# EAGLE design arcie (EAGLE 6.3)
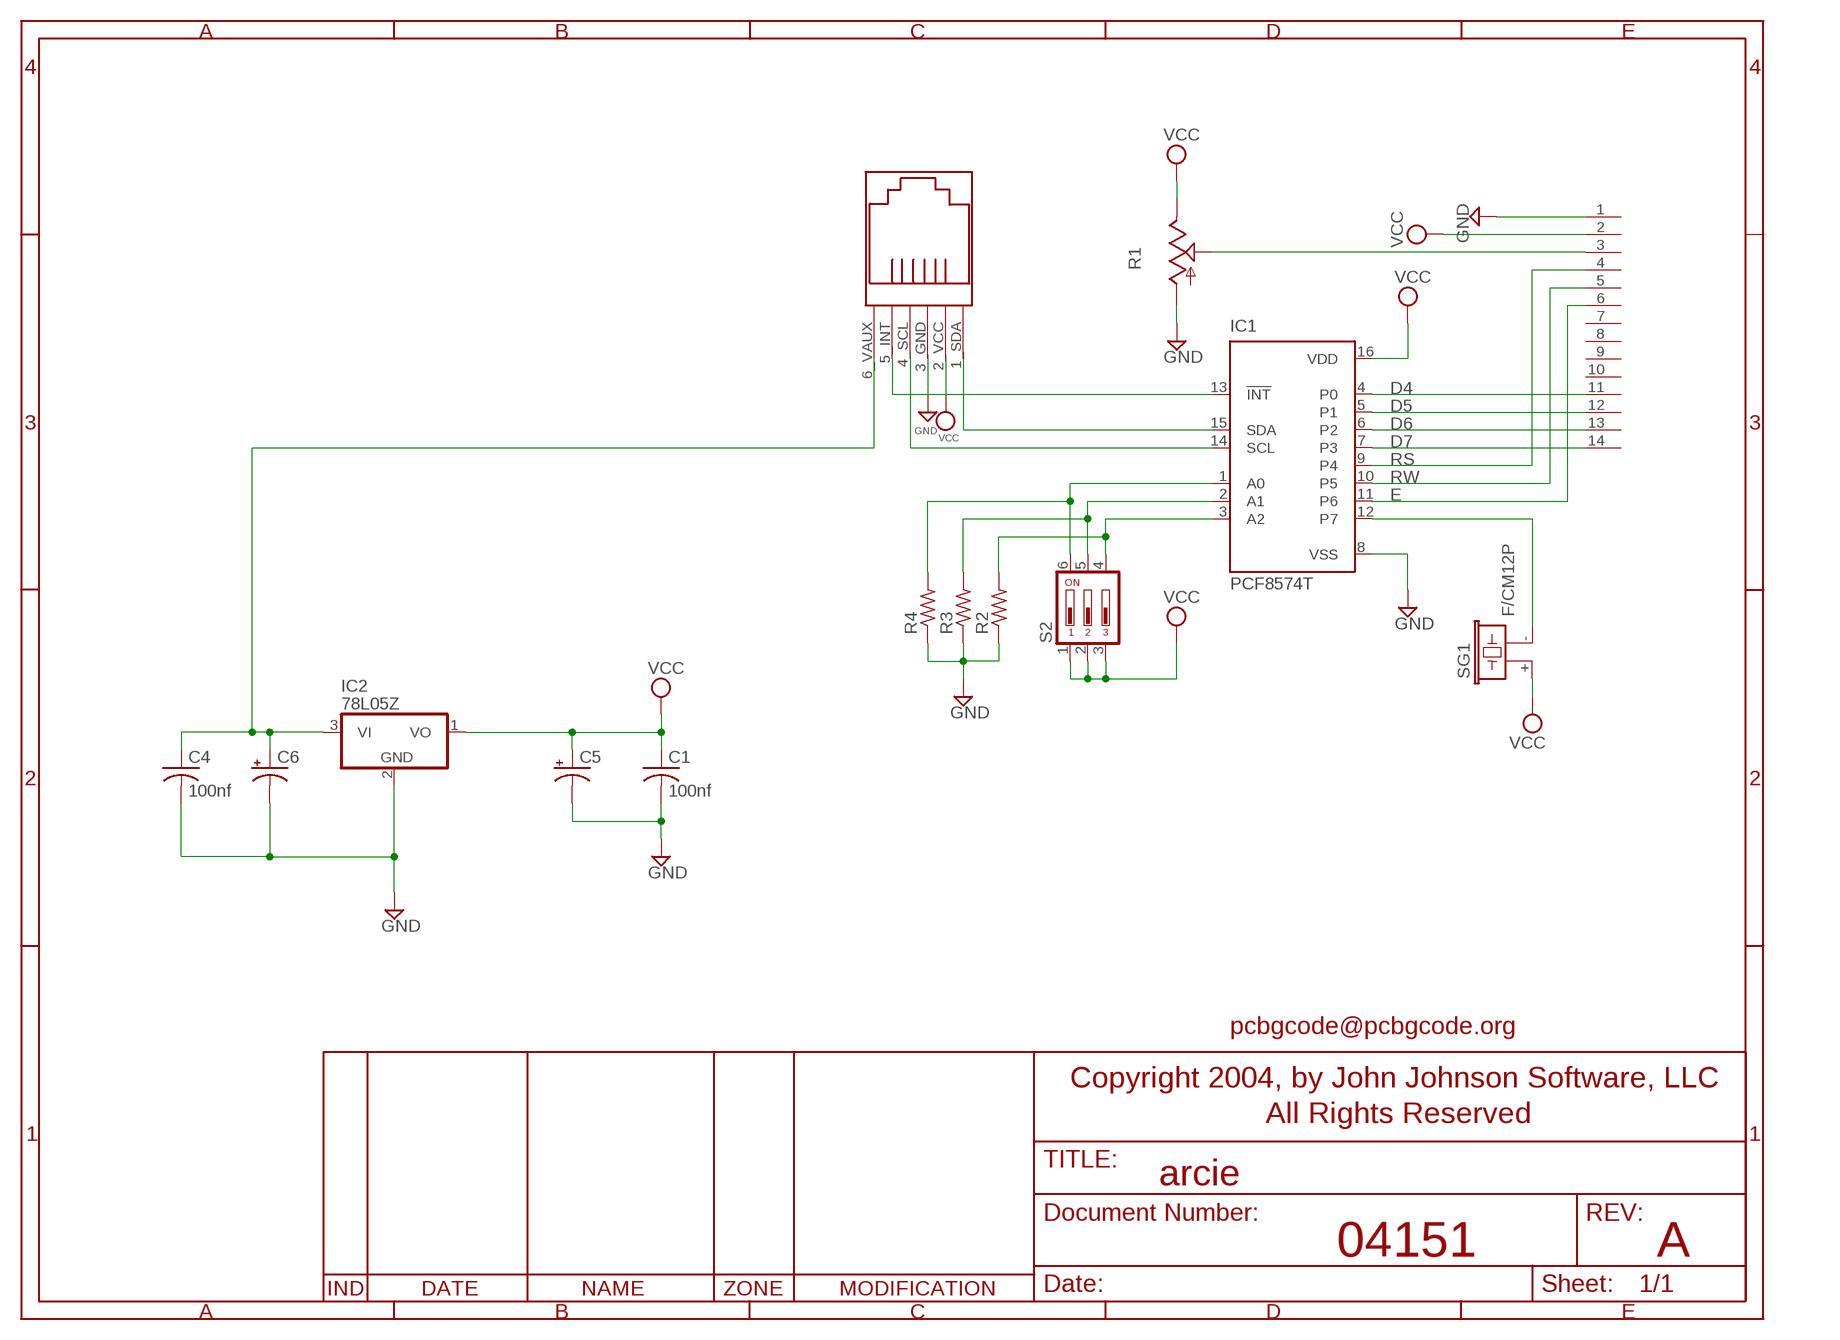
[diagram p0: schematic, sheet 1]

## Parts
C1  100nf  C-USC1206  [C1206]
C4  100nf  C-USC1206  [C1206]
C5  CPOL-US!FAT_E2,5-5  [!FAT_E2,5-5]
C6  CPOL-US!FAT_E2,5-5  [!FAT_E2,5-5]
IC1  PCF8574T  [SO16W]
IC2  78L05Z  [TO92]
R1  TRIM_US-PT-SPIN  [PT-SPIN]
R2  R-US_R1206  [R1206]
R3  R-US_R1206  [R1206]
R4  R-US_R1206  [R1206]
S2  DIP03YL  [DIP03YL]
SG1  F/CM12P  [F/CM12P]
U$1  RJ-12  [RJ-12]
U$2  MA07-2-SGL  [MA07-2]

## Nets
D4: IC1.4(P0) U$2.11
D5: IC1.5(P1) U$2.12
D6: IC1.6(P2) U$2.13
D7: IC1.7(P3) U$2.14
E: IC1.11(P6) U$2.6
GND: C1.2 C4.2 C5.P$2(-) C6.P$2(-) IC1.8(VSS) IC2.2(GND) R1.A R2.1 R3.1 R4.1 U$1.3_GND U$2.1
N$1: R1.S U$2.3
N$2: IC1.3(A2) R2.2 S2.4
N$3: IC1.2(A1) R3.2 S2.5
N$4: IC1.1(A0) R4.2 S2.6
N$5: IC1.13(!INT) U$1.5_INT
N$7: IC1.15(SDA) U$1.1_SDA
N$8: IC1.12(P7) SG1.-
N$9: IC1.14(SCL) U$1.4_SCL
N$12: C4.1 C6.P$1(+) IC2.3(VI) U$1.6_VAUX
RS: IC1.9(P4) U$2.4
RW: IC1.10(P5) U$2.5
VCC: C1.1 C5.P$1(+) IC1.16(VDD) IC2.1(VO) R1.E S2.1 S2.2 S2.3 SG1.+ U$1.2_VCC U$2.2
Unconnected: U$2.7 U$2.8 U$2.9 U$2.10

## Notes on the sheet
- pcbgcode@pcbgcode.org
- 04151 | A

## Library data of the parts
C1 C4 = rcl:C-US: CAPACITOR, American symbol
C5 C6 = rcl:CPOL-US: POLARIZED CAPACITOR, American symbol
IC1 = micro-philips:PCF8574: I2C-Bus I/O DEVICE
IC2 = linear:78*: Positive VOLTAGE REGULATOR
R1 = pot:TRIM_US-: POTENTIOMETER
R2-R4 = rcl:R-US_: RESISTOR, American symbol
S2 = switch-dil:DIP03YL: DIL/CODE SWITCH
SG1 = buzzer:F/CM12P: BUZZER Source: Buerklin
U$1 = con-rj:RJ-12
U$2 = con-lstb:MA07-2-SGL

## Net classes
0 default: width 0.406 mm

## Board
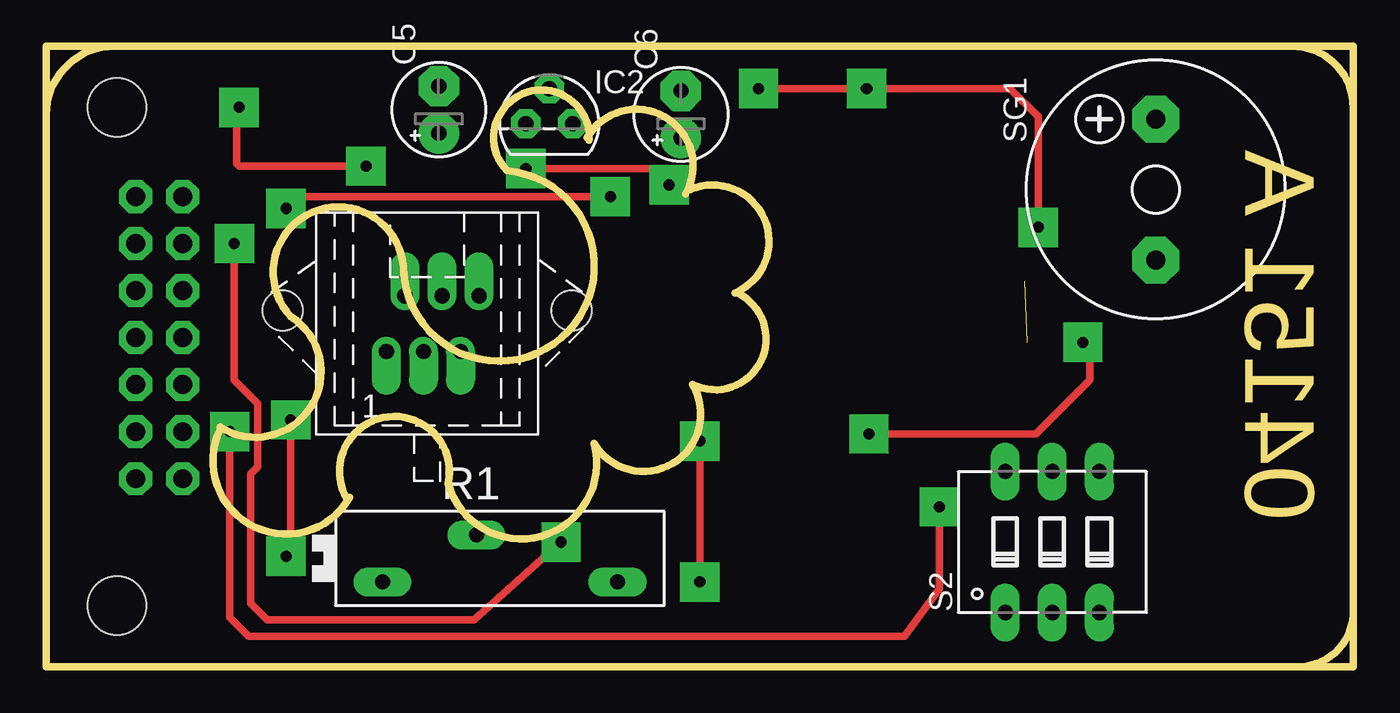
[diagram p1: board, top side]
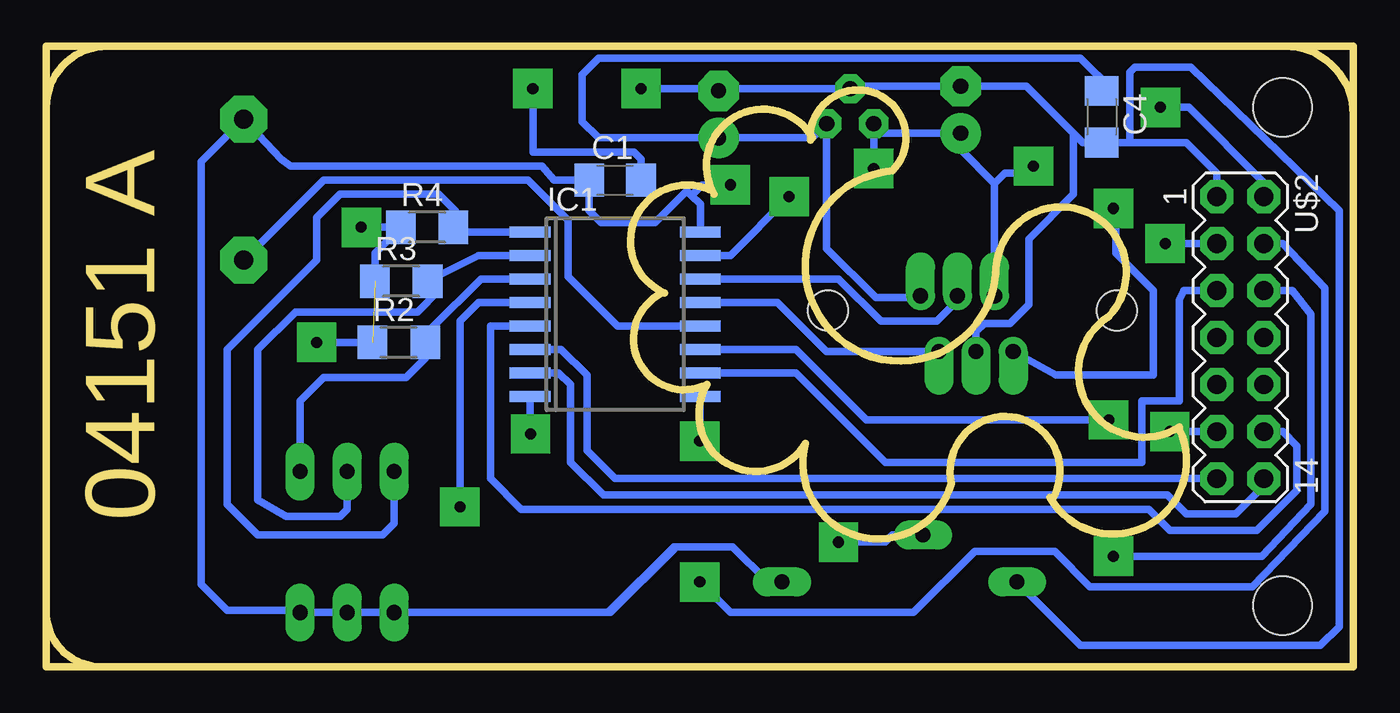
[diagram p2: board, bottom side, seen from below]

Size 70.61 x 33.53 mm. Coordinates in mm from the lower left corner, seen from the top.
Outline: 0,0 70.61,0 70.61,33.53 0,33.53 0,0
Copper layers (1*16): Top 0.035mm / dielectric 1.5mm / Bottom 0.035mm
Design rules "default *": minimum track width 16mil, minimum drill 18mil, track to track 10mil, track to pad 5mil, pad to pad 10mil, via to via 10mil, smd to smd 10mil, copper to edge 0mil, drill to drill 8mil, minimum pad ring 10mil, minimum via ring 30mil, stop-mask expansion 4mil, vias tented up to drill 0mil, thermal gap 16mil
Holes 3.17 mm at 3.81,30.23 3.81,3.3
Milling: 19 lines

### Footprints (pad centres in the part's own frame; a part is rotated, then mirrored left to right if it is on the bottom)
C1206 = smd 1.6 x 1.8: 1 -1.4,0; 2 1.4,0
!FAT_E2,5-5 = drill 0.813 pad 2.184: P$1 -1.27,0 | drill 0.813 pad 2.184 octagon: P$2 1.27,0
SO16W = smd 0.6 x 2.2: 1 -4.445,-4.6; 2 -3.175,-4.6; 3 -1.905,-4.6; 4 -0.635,-4.6; 5 0.635,-4.6; 6 1.905,-4.6; 7 3.175,-4.6; 8 4.445,-4.6; 9 4.445,4.6; 10 3.175,4.6; 11 1.905,4.6; 12 0.635,4.6; 13 -0.635,4.6; 14 -1.905,4.6; 15 -3.175,4.6; 16 -4.445,4.6
TO92 = drill 0.813 octagon: 1 -1.27,0; 2 0,1.905; 3 1.27,0
PT-SPIN = drill 0.813 long: A -6.35,-1.27; E 6.35,-1.27; S -1.27,1.27
R1206 = smd 1.6 x 1.803: 1 -1.422,0; 2 1.422,0
DIP03YL = drill 0.813 long: 1 -2.54,-3.81; 2 0,-3.81; 3 2.54,-3.81; 4 2.54,3.81; 5 0,3.81; 6 -2.54,3.81
F/CM12P = drill 1.016 pad 2.54 octagon: + 3.81,0; - -3.81,0
RJ-12 = drill 0.813 offset: 1_SDA 2.2,1.5; 2_VCC 1.2,-1.5; 3_GND 0.2,1.5; 4_SCL -0.8,-1.5; 5_INT -1.8,1.5; 6_VAUX -2.8,-1.5 | hole 2.184: -7.8,-0.7; 7.8,-0.7
MA07-2 = drill 1.016 octagon: 1 -7.62,-1.27; 2 -7.62,1.27; 3 -5.08,-1.27; 4 -5.08,1.27; 5 -2.54,-1.27; 6 -2.54,1.27; 7 0,-1.27; 8 0,1.27; 9 2.54,-1.27; 10 2.54,1.27; 11 5.08,-1.27; 12 5.08,1.27; 13 7.62,-1.27; 14 7.62,1.27

### Placement (x,y rotation side)
C1  39.88,26.29 0 bottom
C4  13.59,29.72 270 bottom
C5  21.21,30.1 90 top
C6  34.29,29.84 90 top
IC1  39.88,19.05 270 bottom
IC2  27.18,29.34 0 top
R1  24.51,5.84 0 top
R2  51.56,17.53 0 bottom
R3  51.44,20.83 0 bottom
R4  50.04,23.75 0 bottom
S2  54.36,6.73 0 top
SG1  59.94,25.78 90 top
U$1  20.57,18.54 180 top
U$2  6.1,17.78 270 bottom

### Tracks (layer width: path | path; a pad name or v marks a point on that pad's centre or on a via)
D4  (via drill 0.6)
  Top 0.406: v48.26,8.64 48.26,4.19 46.35,1.65 10.92,1.65 9.91,2.67 v9.91,12.7
  Bottom 0.406: U$2.11 v9.91,12.7 | v48.26,8.64 48.26,18.67 47.24,19.68 IC1.4
D5
  Bottom 0.406: U$2.12 3.81,12.7 3.05,11.94 3.05,9.53 5.21,7.37 9.91,7.37 11.05,8.51 44.96,8.51 46.61,10.16 46.61,18.41 IC1.5
D6
  Bottom 0.406: IC1.6 42.8,17.14 41.4,15.75 41.4,11.68 39.88,10.16 U$2.13
D7
  Bottom 0.406: U$2.14 4.83,9.78 6.35,8.26 9.02,8.26 10.03,9.27 40.51,9.27 42.29,11.05 42.29,15.24 42.93,15.88 IC1.7
E  (via drill 0.6)
  Top 0.406: v13.21,13.34 13.21,6.22 v12.95,5.97
  Bottom 0.406: IC1.11 30.1,17.14 26.29,13.34 v13.21,13.34 | v12.95,5.97 4.95,5.97 2.29,8.76 2.29,19.05 3.3,20.32 U$2.6
GND  (via drill 0.6)  (1 unrouted)
  Top 0.406: v44.45,12.57 53.47,12.57 56.39,15.49 56.39,17.4 v56.01,17.53 | v53.59,23.75 53.59,29.72 52.07,31.24 v44.32,31.24 | v44.32,31.24 v38.48,31.24 | 44.45,31.11 v44.32,31.24
  Bottom 0.406: 20.19,31.37 C5.P$2 | C5.P$2 27.05,31.37 IC2.2 34.16,31.24 C6.P$2 34.42,31.24 v38.48,31.24 | U$2.1 7.37,26.67 9.02,28.32 12.06,28.32 | 12.06,28.32 12.95,28.32 C4.2 14.6,28.32 15.11,28.83 | 15.11,28.83 17.65,31.37 C5.P$2 | U$1.3_GND 20.37,18.11 19.94,18.54 18.54,18.54 17.53,19.56 17.53,23.11 15.11,25.53 15.11,28.83 | 12.06,28.32 12.06,32.13 11.81,32.38 8.76,32.38 0.76,24.64 0.76,2.16 1.78,1.14 14.73,1.14 R1.A | IC1.8 44.48,12.6 v44.45,12.57 | v56.01,17.53 R2.1 | R3.1 52.86,22.35 R4.1 v53.59,23.75 | C1.2 38.48,27.43 38.86,27.81 44.32,27.81 v44.32,31.24
N$1  (via drill 0.6)
  Top 0.406: v10.16,22.86 10.16,15.49 11.43,14.22 11.43,10.79 11.05,10.41 11.05,3.43 11.94,2.54 23.11,2.54 v27.81,6.73
  Bottom 0.406: U$2.3 v10.16,22.86 | v27.81,6.73 25.27,6.73 24.89,7.11 R1.S
N$2
  Bottom 0.406: S2.4 56.9,14.35 55.63,15.62 51.18,15.62 50.14,16.66 R2.2 49.78,17.88 49.78,18.29 47.12,20.95 IC1.3
N$3
  Bottom 0.406: IC1.2 47.24,22.23 49.78,20.95 49.51,20.45 R3.2 49.38,20.34 50.55,19.18 57.15,19.18 59.18,17.14 59.18,9.02 57.66,8.13 54.74,8.13 54.36,8.51 S2.5
N$4
  Bottom 0.406: IC1.1 48.49,23.5 | 48.49,23.5 R4.2 | 48.49,23.5 48.49,24.61 49.4,25.53 54.74,25.53 56.01,24.26 56.01,21.97 60.83,17.14 60.83,8.76 59.18,7.11 52.45,7.11 51.82,7.75 S2.6
N$5
  Bottom 0.406: U$1.5_INT 28.47,17.04 31.11,19.68 IC1.13
N$7  (via drill 0.6)
  Top 0.406: v30.48,25.4 13.84,25.4 v12.95,24.77
  Bottom 0.406: IC1.15 33.66,22.23 v30.48,25.4 | v12.95,24.77 12.83,24.77 12.83,22.35 10.79,20.32 10.79,15.75 16.06,15.75 U$1.1_SDA
N$8
  Bottom 0.406: IC1.12 39.75,18.41 42.42,21.08 42.42,24.13 44.58,26.29 55.63,26.29 SG1.-
N$9
  Bottom 0.406: U$1.4_SCL 21.37,19.77 22.48,18.67 25.53,18.67 27.81,20.95 IC1.14
N$12
  Bottom 0.406: U$1.6_VAUX 23.48,19.94 25.78,19.94 28.45,22.61 IC2.3 29.21,28.57 C6.P$1 40.77,28.57 41.66,29.46 41.66,32 40.77,32.89 14.73,32.89 12.96,31.12 C4.1
RS  (via drill 0.6)
  Top 0.406: v35.31,4.57 v35.31,12.19
  Bottom 0.406: U$2.4 3.81,22.86 1.52,20.45 1.52,8.38 5.46,4.32 14.22,4.32 16.13,6.22 20.45,6.22 23.75,2.92 33.66,2.92 v35.31,4.57 | v35.31,12.19 35.31,14.58 IC1.9
RW
  Bottom 0.406: IC1.10 30.1,15.88 25.27,11.05 11.43,11.05 11.43,14.35 9.4,14.35 9.4,19.81 9.14,20.32 U$2.5
VCC  (via drill 0.6)
  Top 0.406: v25.91,26.92 32.77,26.92 v33.66,26.04 | v17.27,27.05 10.41,27.05 10.29,27.18 10.29,30.1 v10.41,30.23
  Bottom 0.406: U$1.2_VCC 19.37,26.11 | 19.37,26.11 21.21,27.94 C5.P$1 25.4,28.83 IC2.1 v25.91,26.92 | U$2.2 4.83,26.16 8.89,30.23 v10.41,30.23 | 19.37,26.11 18.81,26.67 17.65,26.67 v17.27,27.05 | IC1.16 35.28,24.99 35.75,25.46 | 35.75,25.46 35.94,25.65 36.07,25.65 37.72,24 40.64,24 41.27,24.64 C1.1 43.18,26.29 43.81,27.05 57.4,27.05 57.91,27.43 SG1.+ 62.23,27.3 62.23,4.45 60.83,3.05 57.02,3.05 S2.3 S2.2 S2.1 40.26,2.92 36.7,6.48 | R1.E 31.62,4.57 33.53,6.48 36.7,6.48 | v33.66,26.04 35.18,26.04 35.75,25.46 | 36.7,6.48 36.7,6.35 40.13,2.92 51.69,2.92 51.82,3.05

### Text on the board
Milling: 04151 A